# Altium project RX.PrjPCB
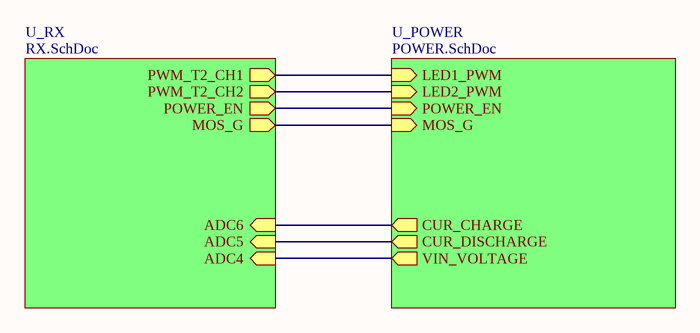
[diagram p0: TOP.SchDoc]
3 sheets, 116 parts. Net scope: hierarchical (ports join the sheet entries above them; power ports are global).
Board file: RX_fp.PcbDoc
Sheets:
  TOP.SchDoc
    U_POWER = POWER.SchDoc
    U_RX = RX.SchDoc

## Sheet TOP.SchDoc
size A4

### Sub-sheets
U_POWER = POWER.SchDoc: CUR_CHARGE (out), CUR_DISCHARGE (out), POWER_EN (in), MOS_G (in), LED1_PWM (in), LED2_PWM (in), VIN_VOLTAGE (out)
U_RX = RX.SchDoc: PWM_T2_CH1 (out), PWM_T2_CH2 (out), ADC4 (in), ADC5 (in), ADC6 (in), POWER_EN (out), MOS_G (out)

### Nets
CUR_CHARGE: sheet U_POWER/CUR_CHARGE, sheet U_RX/ADC6
CUR_DISCHARGE: sheet U_POWER/CUR_DISCHARGE, sheet U_RX/ADC5
LED1: sheet U_POWER/LED1_PWM, sheet U_RX/PWM_T2_CH1
LED2: sheet U_POWER/LED2_PWM, sheet U_RX/PWM_T2_CH2
MOS_G: sheet U_POWER/MOS_G, sheet U_RX/MOS_G
POWER_EN: sheet U_POWER/POWER_EN, sheet U_RX/POWER_EN
NetC1_1: sheet U_POWER/VIN_VOLTAGE, sheet U_RX/ADC4

## Sheet POWER.SchDoc
size A4
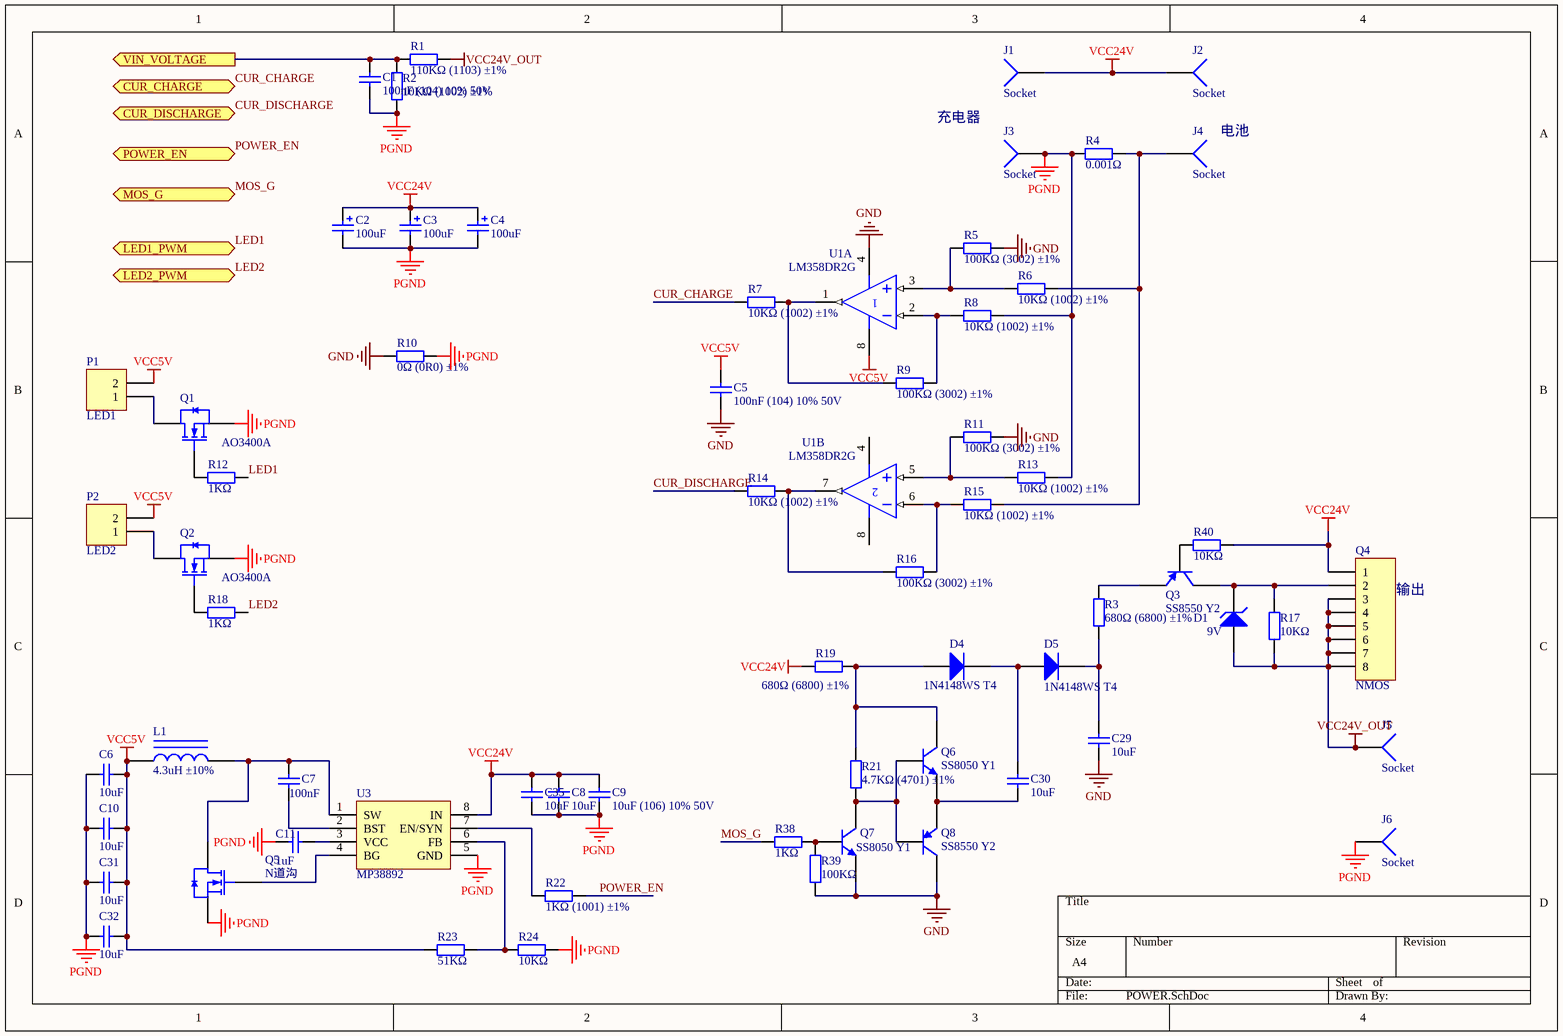
[diagram p1: POWER.SchDoc]

### Parts
C1  100nF (104) 10% 50V  [0603_C]
C2  100uF  [CC6.56.5]
C3  100uF  [CC6.56.5]
C4  100uF  [CC6.56.5]
C5  100nF (104) 10% 50V  [0603_C]
C6  10uF  [1206_C]
C7  100nF  [0603_C]
C8  10uF  [1206_C]
C9  10uF (106) 10% 50V  [1206_C]
C10  10uF  [1206_C]
C11  1uF  [0603_C]
C29  10uF  [0805_C]
C30  10uF  [0805_C]
C31  10uF  [1206_C]
C32  10uF  [1206_C]
C35  10uF  [1206_C]
D1  9V  [LL-34]
D4  1N4148WS T4  [SOD-323]
D5  1N4148WS T4  [SOD-323]
J1  Socket  [PIN1]
J2  Socket  [PIN1]
J3  Socket  [PIN1]
J4  Socket  [PIN1]
J5  Socket  [PIN1]
J6  Socket  [PIN1]
L1  4.3uH ±10%  [2225]
P1  LED1  [HDR1X2]
P2  LED2  [HDR1X2]
Q1  AO3400A  [SOT-23-3L]
Q2  AO3400A  [SOT-23-3L]
Q3  SS8550 Y2  [SOT-23(SOT-23-3)]
Q4  NMOS  [TO-263-7]
Q5  N道沟  [TO-252-2]
Q6  SS8050 Y1  [SOT-23(SOT-23-3)]
Q7  SS8050 Y1  [SOT-23(SOT-23-3)]
Q8  SS8550 Y2  [SOT-23(SOT-23-3)]
R1  110KΩ (1103) ±1%  [0603_R]
R2  10KΩ (1002) ±1%  [0603_R]
R3  680Ω (6800) ±1%  [0603_R]
R4  0.001Ω  [2512_R]
R5  100KΩ (3002) ±1%  [0603_R]
R6  10KΩ (1002) ±1%  [0603_R]
R7  10KΩ (1002) ±1%  [0603_R]
R8  10KΩ (1002) ±1%  [0603_R]
R9  100KΩ (3002) ±1%  [0603_R]
R10  0Ω (0R0) ±1%  [0603_R]
R11  100KΩ (3002) ±1%  [0603_R]
R12  1KΩ  [0603_R]
R13  10KΩ (1002) ±1%  [0603_R]
R14  10KΩ (1002) ±1%  [0603_R]
R15  10KΩ (1002) ±1%  [0603_R]
R16  100KΩ (3002) ±1%  [0603_R]
R17  10KΩ  [0603_R]
R18  1KΩ  [0603_R]
R19  680Ω (6800) ±1%  [0603_R]
R21  4.7KΩ (4701) ±1%  [0603_R]
R22  1KΩ (1001) ±1%  [0603_R]
R23  51KΩ  [0603_R]
R24  10KΩ  [0603_R]
R38  1KΩ  [0603_R]
R39  100KΩ  [0603_R]
R40  10KΩ  [0603_R]
U1  LM358DR2G  [SOIC-8_150mil]  (parts A,B of 2)
U3  MP38892  [SOIC-8_EP_150mil]

### Ports
CUR_CHARGE (out), CUR_DISCHARGE (out), LED1_PWM (in), LED2_PWM (in), MOS_G (in), POWER_EN (in), VIN_VOLTAGE (out)

### Nets
GND: C5.2 C29.1 Q7.2(E) Q8.3(C) R5.1 R10.1 R11.1 R39.1 U1.4(V-)
PGND: C1.2 C2.2 C3.2 C4.2 C6.2 C8.1 C9.1 C10.2 C11.2 C31.2 C32.2 C35.2 J3.1 J6.1 Q1.2(S) Q2.2(S) Q5.2(S) R2.1 R4.2 R8.2 R10.2 R13.2 R24.1 U3.5(GND)
VCC5V: C5.1 C6.1 C10.1 C31.1 C32.1 L1.1 P1.2 P2.2 R23.2 U1.8(V+)
VCC24V: C2.1 C3.1 C4.1 C8.2 C9.2 C35.1 J1.1 J2.1 Q4.1 R19.2 R40.1 U3.8(IN)
VCC24V_OUT: D1.1(A) J5.1 Q4.3 Q4.4 Q4.5 Q4.6 Q4.7 Q4.8 R1.1 R17.1
CUR_CHARGE: R7.1 ; port CUR_CHARGE
CUR_DISCHARGE: R14.1 ; port CUR_DISCHARGE
LED1: R12.1 ; port LED1_PWM
LED2: R18.1 ; port LED2_PWM
MOS_G: R38.1 ; port MOS_G
POWER_EN: R22.2 ; port POWER_EN
NetC1_1: C1.1 R1.2 R2.2 ; port VIN_VOLTAGE
NetC7_1: C7.1 U3.2(BST)
NetC7_2: C7.2 L1.2 Q5.3(D) U3.1(SW)
NetC11_1: C11.1 U3.3(VCC)
NetC29_2: C29.2 D5.2(K) R3.2
NetC30_1: C30.1 Q6.2(E) Q8.2(E)
NetC30_2: C30.2 D4.2(K) D5.1(A)
NetD1_2: D1.2(K) Q3.3(C) Q4.2 R17.2
NetD4_1: D4.1(A) Q6.3(C) R19.1 R21.2
NetJ4_1: J4.1 R4.1 R6.2 R15.2
NetP1_1: P1.1 Q1.3(D)
NetP2_1: P2.1 Q2.3(D)
NetQ1_1: Q1.1(G) R12.2
NetQ2_1: Q2.1(G) R18.2
NetQ3_1: Q3.1(B) R40.2
NetQ3_2: Q3.2(E) R3.1
NetQ5_1: Q5.1(G) U3.4(BG)
NetQ6_1: Q6.1(B) Q7.3(C) Q8.1(B) R21.1
NetQ7_1: Q7.1(B) R38.2 R39.2
NetR5_2: R5.2 R6.1 U1.3(IN+)
NetR7_2: R7.2 R9.1 U1.1(OUT)
NetR8_1: R8.1 R9.2 U1.2(IN-)
NetR11_2: R11.2 R13.1 U1.5(IN+)
NetR14_2: R14.2 R16.1 U1.7(OUT)
NetR15_1: R15.1 R16.2 U1.6(IN-)
NetR22_1: R22.1 U3.7(EN/SYN)
NetR23_1: R23.1 R24.2 U3.6(FB)

### Notes on the sheet
- 充电器
- (near J4) 电池
- (near Q4) 输出

### Library data of the parts
C1 C5 C7 = 0603 100nF (104) 10% 50V: 贴片电容; ComponentLink1Description: 供应商链接; ComponentLink1URL: http://www.szlcsc.com/product/details_15331.html; Package: 0603; Supplier: LC; SuppliersPartNumber: C14663
C2-C4 = 3528 100uF (107) 10% 6.3V: 钽电容; ComponentLink1Description: 供应商链接; ComponentLink1URL: http://www.szlcsc.com/product/details_16815.html; Package: 3528; Supplier: LC; SuppliersPartNumber: C16133
C6 C8-C10 C31 C32 C35 = 1206 10uF (106) 10% 50V: 贴片电容; ComponentLink1Description: 供应商链接; ComponentLink1URL: http://www.szlcsc.com/product/details_14236.html; Package: 1206; Supplier: LC; SuppliersPartNumber: C13585
C11 = 0603 1uF (105) 10% 50V: 贴片电容; ComponentLink1Description: 供应商链接; ComponentLink1URL: http://www.szlcsc.com/product/details_16531.html; Package: 0603; Supplier: LC; SuppliersPartNumber: C15849
C29 C30 = 0805 10uF (106) 10% 25V: 贴片电容; ComponentLink1Description: 供应商链接; ComponentLink1URL: http://www.szlcsc.com/product/details_16532.html; Package: 0805; Supplier: LC; SuppliersPartNumber: C15850
D1 = LL-34 ZMM5V6: 稳压二极管; ComponentLink1Description: 供应商链接; ComponentLink1URL: http://www.szlcsc.com/product/details_8541.html; Package: LL-34; Supplier: LC; SuppliersPartNumber: C8062
D4 D5 = SOD-323 1N4148WS T4: 二极管; ComponentLink1Description: 供应商链接; ComponentLink1URL: http://www.szlcsc.com/product/details_2485.html; Package: SOD-323; Supplier: LC; SuppliersPartNumber: C2128
L1 = 0805 10uH 10%: 贴片电感; ComponentLink1Description: 供应商链接; ComponentLink1URL: http://www.szlcsc.com/product/details_1398.html; Package: 0805; Supplier: LC; SuppliersPartNumber: C1046
P1 P2 = Header 2: Header, 2-Pin; LatestRevisionDate: 17-Jul-2002; LatestRevisionNote: Re-released for DXP Platform.; Publisher: Altium Limited
Q1 Q2 = AO3400A N道沟 X0YV1T SOT-23: MOS(场效应管); ComponentLink1Description: 供应商链接; ComponentLink1URL: http://www.szlcsc.com/product/details_21629.html; Package: SOT-23; Supplier: LC; SuppliersPartNumber: C20917
Q3 Q8 = SOT-23 SS8550 Y2: 三极管; ComponentLink1Description: 供应商链接; ComponentLink1URL: http://www.szlcsc.com/product/details_9037.html; Package: SOT-23; Supplier: LC; SuppliersPartNumber: C8542
Q4 = Header 8: Header, 8-Pin; pin to pad: 1>0 2>1 3>2 4>3 5>4 6>5 7>6 8>7; LatestRevisionDate: 17-Jul-2002; LatestRevisionNote: Re-released for DXP Platform.; Publisher: Altium Limited
Q5 = AO3400A N道沟 X0YV1T SOT-23: MOS(场效应管); pin to pad: 2>3 3>2; ComponentLink1Description: 供应商链接; ComponentLink1URL: http://www.szlcsc.com/product/details_21629.html; Package: SOT-23; Supplier: LC; SuppliersPartNumber: C20917
Q6 Q7 = SOT-23 SS8050 Y1: 三极管; ComponentLink1Description: 供应商链接; ComponentLink1URL: http://www.szlcsc.com/product/details_2507.html; Package: SOT-23; Supplier: LC; SuppliersPartNumber: C2150
R1 = 0603 110KΩ (1103) 1%: 贴片电阻; ComponentLink1Description: 供应商链接; ComponentLink1URL: http://www.szlcsc.com/product/details_26548.html; Package: 0603; Supplier: LC; SuppliersPartNumber: C25805
R2 R6-R8 R13-R15 R17 R24 R40 = 0603 10KΩ (1002) 1%: 贴片电阻; ComponentLink1Description: 供应商链接; ComponentLink1URL: http://www.szlcsc.com/product/details_26547.html; Package: 0603; Supplier: LC; SuppliersPartNumber: C25804
R3 R19 = 0603 680Ω (6800) 1%: 贴片电阻; ComponentLink1Description: 供应商链接; ComponentLink1URL: http://www.szlcsc.com/product/details_23955.html; Package: 0603; Supplier: LC; SuppliersPartNumber: C23228
R4 R10 = 0603 0Ω (0R0) 1%: 贴片电阻; ComponentLink1Description: 供应商链接; ComponentLink1URL: http://www.szlcsc.com/product/details_21903.html; Package: 0603; Supplier: LC; SuppliersPartNumber: C21189
R5 R9 R11 R16 R39 = 0603 30KΩ (3002) 1%: 贴片电阻; ComponentLink1Description: 供应商链接; ComponentLink1URL: http://www.szlcsc.com/product/details_23711.html; Package: 0603; Supplier: LC; SuppliersPartNumber: C22984
R12 R18 R22 R38 = 0603 1KΩ (1001) 1%: 贴片电阻; ComponentLink1Description: 供应商链接; ComponentLink1URL: http://www.szlcsc.com/product/details_21904.html; Package: 0603; Supplier: LC; SuppliersPartNumber: C21190
R21 = 0603 4.7KΩ (4701) 1%: 贴片电阻; ComponentLink1Description: 供应商链接; ComponentLink1URL: http://www.szlcsc.com/product/details_23889.html; Package: 0603; Supplier: LC; SuppliersPartNumber: C23162
R23 = 0603 51KΩ (5102) 1%: 贴片电阻; ComponentLink1Description: 供应商链接; ComponentLink1URL: http://www.szlcsc.com/product/details_23923.html; Package: 0603; Supplier: LC; SuppliersPartNumber: C23196
U1 = LM358DR2G: 通用运放; ComponentLink1Description: 供应商链接; ComponentLink1URL: http://www.szlcsc.com/product/details_8427.html; Package: SOIC-8; Supplier: LC; SuppliersPartNumber: C7950
J1-J6 = Socket: LatestRevisionDate: 17-Jul-2002; LatestRevisionNote: Re-released for DXP Platform.; Publisher: Altium Limited

## Sheet RX.SchDoc
size A4
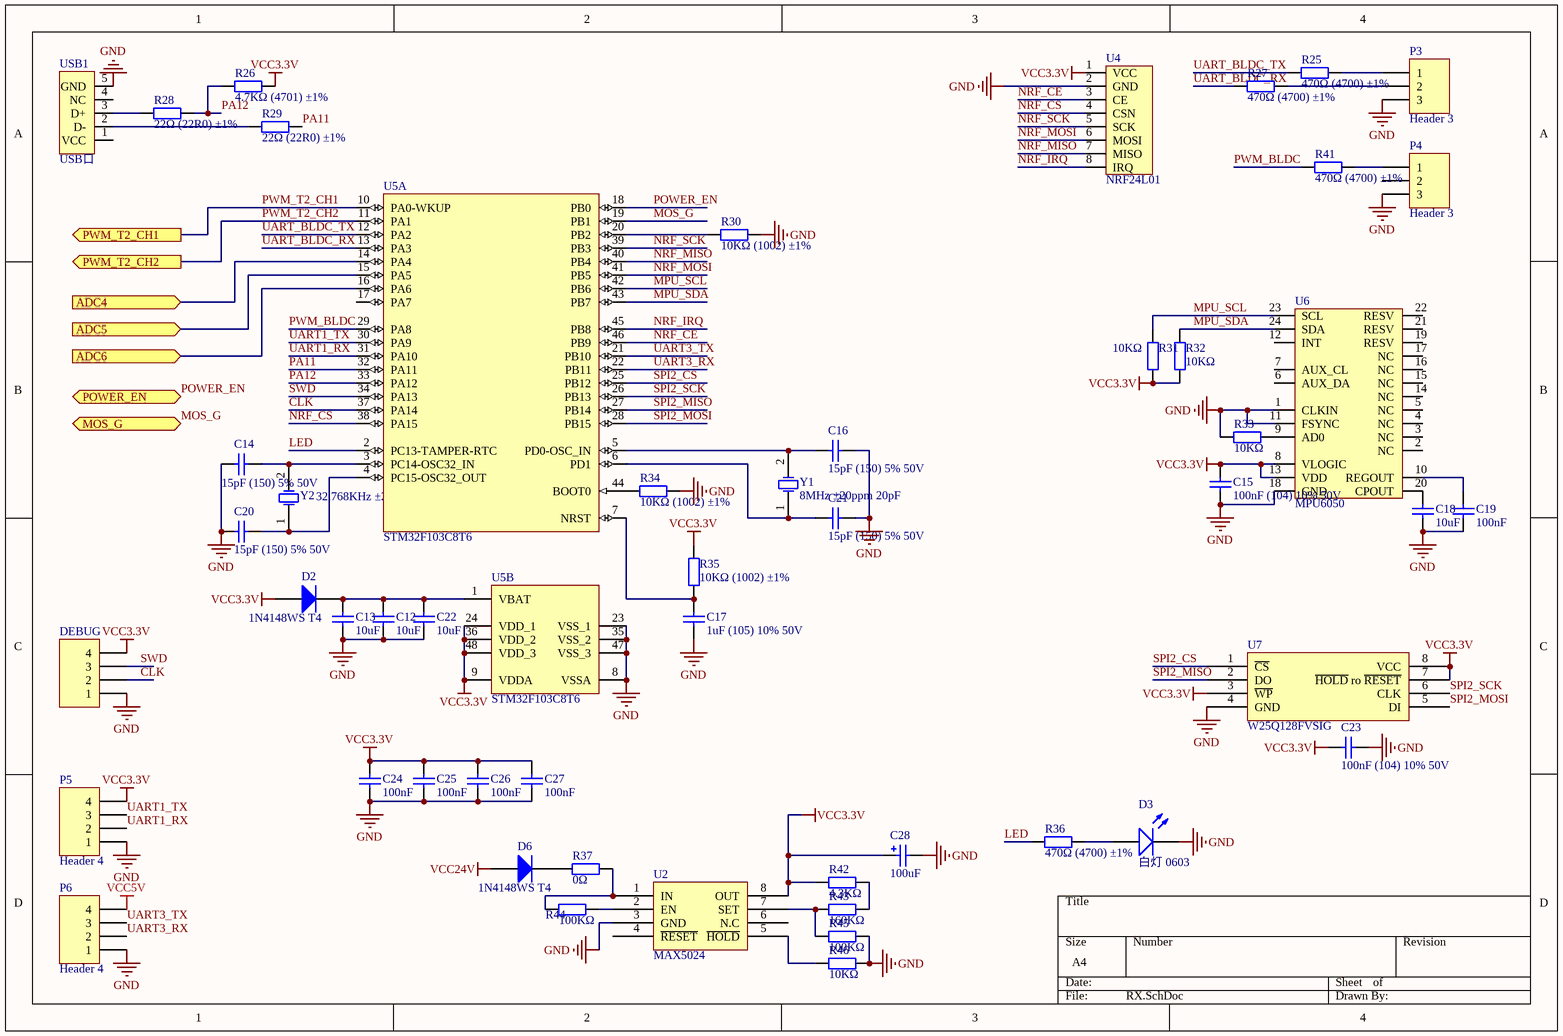
[diagram p2: RX.SchDoc]

### Parts
C12  10uF  [0603_C]
C13  10uF  [0603_C]
C14  15pF (150) 5% 50V  [0603_C]
C15  100nF (104) 10% 50V  [0603_C]
C16  15pF (150) 5% 50V  [0603_C]
C17  1uF (105) 10% 50V  [0603_C]
C18  10uF  [0603_C]
C19  100nF  [0603_C]
C20  15pF (150) 5% 50V  [0603_C]
C21  15pF (150) 5% 50V  [0603_C]
C22  10uF  [0603_C]
C23  100nF (104) 10% 50V  [0603_C]
C24  100nF  [0603_C]
C25  100nF  [0603_C]
C26  100nF  [0603_C]
C27  100nF  [0603_C]
C28  100uF  [CASE-B_3528]
D2  1N4148WS T4  [SOD-323]
D3  白灯 0603  [0603_LED_S1]
D6  1N4148WS T4  [SOD-323]
DEBUG  Header 4  [HDR1X4]  (value not drawn)
P3  Header 3  [HDR1X3]
P4  Header 3  [HDR1X3]
P5  Header 4  [HDR1X4]
P6  Header 4  [HDR1X4]
R25  470Ω (4700) ±1%  [0603_R]
R26  4.7KΩ (4701) ±1%  [0603_R]
R27  470Ω (4700) ±1%  [0603_R]
R28  22Ω (22R0) ±1%  [0603_R]
R29  22Ω (22R0) ±1%  [0603_R]
R30  10KΩ (1002) ±1%  [0603_R]
R31  10KΩ  [0603_R]
R32  10KΩ  [0603_R]
R33  10KΩ  [0603_R]
R34  10KΩ (1002) ±1%  [0603_R]
R35  10KΩ (1002) ±1%  [0603_R]
R36  470Ω (4700) ±1%  [0603_R]
R37  0Ω  [0805_R]
R41  470Ω (4700) ±1%  [0603_R]
R42  4.3KΩ  [0603_R]
R43  160KΩ  [0603_R]
R44  100KΩ  [0603_R]
R45  100KΩ  [0603_R]
R46  10KΩ  [0603_R]
U2  MAX5024  [SOIC-8_EP_150mil]
U4  NRF24L01  [miniNRF24L01]
U5  STM32F103C8T6  [LQFP-48_7x7x05P]  (parts A,B of 2)
U6  MPU6050  [QFN24]
U7  W25Q128FVSIG  [SOIC-8_208mil]
USB1  USB口  [MICRO USB]
Y1  8MHz ±20ppm 20pF  [SMD-3215_2P FC - 135]
Y2  32.768KHz ±20ppm 12.5pF  [SMD-3215_2P FC - 135]

### Ports
ADC4 (in), ADC5 (in), ADC6 (in), MOS_G (out), POWER_EN (out), PWM_T2_CH1 (out), PWM_T2_CH2 (out)

### Nets
GND: C12.1 C13.1 C14.1 C15.2 C16.2 C17.1 C18.1 C19.2 C20.1 C21.2 C22.1 C23.1 C24.2 C25.2 C26.2 C27.2 C28.2 D3.K DEBUG.1 P3.3 P4.3 P5.1 P6.1 R30.2 R33.1 R34.2 R45.2 R46.2 U2.3(GND) U4.2(GND) U5.8(VSSA) U5.23(VSS_1) U5.35(VSS_2) U5.47(VSS_3) U6.1(CLKIN) U6.11(FSYNC) U6.18(GND) U7.4(GND) USB1.5(GND)
VCC3.3V: C15.1 C23.2 C24.1 C25.1 C26.1 C27.1 C28.1 D2.1(A) DEBUG.4 P5.4 R26.2 R31.1 R32.2 R35.2 R42.1 U2.8(OUT) U4.1(VCC) U5.9(VDDA) U5.24(VDD_1) U5.36(VDD_2) U5.48(VDD_3) U6.8(VLOGIC) U6.13(VDD) U7.3(~{WP}) U7.7(~{HOLD}_ro_~{RESET}) U7.8(VCC)
VCC5V: P6.4
VCC24V: D6.1(A)
CLK: DEBUG.2 U5.37(PA14)
CUR_CHARGE: U5.16(PA6) ; port ADC6
CUR_DISCHARGE: U5.15(PA5) ; port ADC5
LED: R36.1 U5.2(PC13-TAMPER-RTC)
MOS_G: U5.19(PB1) ; port MOS_G
MPU_SCL: R31.2 U5.42(PB6) U6.23(SCL)
MPU_SDA: R32.1 U5.43(PB7) U6.24(SDA)
NRF_CE: U4.3(CE) U5.46(PB9)
NRF_CS: U4.4(CSN) U5.38(PA15)
NRF_IRQ: U4.8(IRQ) U5.45(PB8)
NRF_MISO: U4.7(MISO) U5.40(PB4)
NRF_MOSI: U4.6(MOSI) U5.41(PB5)
NRF_SCK: U4.5(SCK) U5.39(PB3)
PA11: R29.2 U5.32(PA11)
PA12: R26.1 R28.2 U5.33(PA12)
POWER_EN: U5.18(PB0) ; port POWER_EN
PWM_BLDC: R41.1 U5.29(PA8)
PWM_T2_CH1: U5.10(PA0-WKUP) ; port PWM_T2_CH1  [project net LED1]
PWM_T2_CH2: U5.11(PA1) ; port PWM_T2_CH2  [project net LED2]
SPI2_CS: U5.25(PB12) U7.1(~{CS})
SPI2_MISO: U5.27(PB14) U7.2(DO)
SPI2_MOSI: U5.28(PB15) U7.5(DI)
SPI2_SCK: U5.26(PB13) U7.6(CLK)
SWD: DEBUG.3 U5.34(PA13)
UART1_RX: P5.2 U5.31(PA10)
UART1_TX: P5.3 U5.30(PA9)
UART3_RX: P6.2 U5.22(PB11)
UART3_TX: P6.3 U5.21(PB10)
UART_BLDC_RX: R27.1 U5.13(PA3)
UART_BLDC_TX: R25.1 U5.12(PA2)
NetC1_1: U5.14(PA4) ; port ADC4
NetC12_2: C12.2 C13.2 C22.2 D2.2(K) U5.1(VBAT)
NetC14_2: C14.2 U5.3(PC14-OSC32_IN) Y2.2(OSC2)
NetC16_1: C16.1 U5.5(PD0-OSC_IN) Y1.2(OSC2)
NetC17_2: C17.2 R35.1 U5.7(NRST)
NetC18_2: C18.2 U6.20(CPOUT)
NetC19_1: C19.1 U6.10(REGOUT)
NetC20_2: C20.2 U5.4(PC15-OSC32_OUT) Y2.1(OSC1)
NetC21_1: C21.1 U5.6(PD1) Y1.1(OSC1)
NetD3_A: D3.A R36.2
NetD6_2: D6.2(K) R37.1
NetP3_1: P3.1 R25.2
NetP3_2: P3.2 R27.2
NetP4_1: P4.1 R41.2
NetR28_1: R28.1 USB1.3(D+)
NetR29_1: R29.1 USB1.2(D-)
NetR30_1: R30.1 U5.20(PB2)
NetR33_2: R33.2 U6.9(AD0)
NetR34_1: R34.1 U5.44(BOOT0)
NetR37_2: R37.2 R44.1 U2.1(IN)
NetR42_2: R42.2 R43.2
NetR43_1: R43.1 R45.1 U2.7(SET)
NetR44_2: R44.2 U2.2(EN)
NetR46_1: R46.1 U2.5(~{HOLD})

Not connected (* = marked no-connect by the designer): P4 2; U2 4(~{RESET}) 6(N.C); U5 17(PA7); U6 2(NC) 3(NC) 4(NC) 5(NC) 6(AUX_DA) 7(AUX_CL) 12(INT) 14(NC) 15(NC) 16(NC) 17(NC) 19(RESV) 21(RESV) 22(RESV); USB1 1(VCC) 4(NC)

### Library data of the parts
C12 C13 C18 C22 = 0603 10uF (106) 10% 10V: 贴片电容; ComponentLink1Description: 供应商链接; ComponentLink1URL: http://www.szlcsc.com/product/details_20411.html; Package: 0603; Supplier: LC; SuppliersPartNumber: C19702
C14 C16 C20 C21 = 0603 15pF (150) 5% 50V: 贴片电容; ComponentLink1Description: 供应商链接; ComponentLink1URL: http://www.szlcsc.com/product/details_1996.html; Package: 0603; Supplier: LC; SuppliersPartNumber: C1644
C15 C19 C23-C27 = 0603 100nF (104) 10% 50V: 贴片电容; ComponentLink1Description: 供应商链接; ComponentLink1URL: http://www.szlcsc.com/product/details_15331.html; Package: 0603; Supplier: LC; SuppliersPartNumber: C14663
C17 = 0603 1uF (105) 10% 50V: 贴片电容; ComponentLink1Description: 供应商链接; ComponentLink1URL: http://www.szlcsc.com/product/details_16531.html; Package: 0603; Supplier: LC; SuppliersPartNumber: C15849
C28 = 3528 100uF (107) 10% 6.3V: 钽电容; ComponentLink1Description: 供应商链接; ComponentLink1URL: http://www.szlcsc.com/product/details_16815.html; Package: 3528; Supplier: LC; SuppliersPartNumber: C16133
D2 D6 = SOD-323 1N4148WS T4: 二极管; ComponentLink1Description: 供应商链接; ComponentLink1URL: http://www.szlcsc.com/product/details_2485.html; Package: SOD-323; Supplier: LC; SuppliersPartNumber: C2128
D3 = 0603 白灯: 发光二极管; ComponentLink1Description: 供应商链接; ComponentLink1URL: http://www.szlcsc.com/product/details_2663.html; Package: 0603; Supplier: LC; SuppliersPartNumber: C2290
DEBUG P5 P6 = Header 4: Header, 4-Pin; LatestRevisionDate: 17-Jul-2002; LatestRevisionNote: Re-released for DXP Platform.; Publisher: Altium Limited
P3 P4 = Header 3: Header, 3-Pin; LatestRevisionDate: 17-Jul-2002; LatestRevisionNote: Re-released for DXP Platform.; Publisher: Altium Limited
R25 R27 R36 R41 = 0603 470Ω (4700) 1%: 贴片电阻; ComponentLink1Description: 供应商链接; ComponentLink1URL: http://www.szlcsc.com/product/details_23906.html; Package: 0603; Supplier: LC; SuppliersPartNumber: C23179
R26 = 0603 4.7KΩ (4701) 1%: 贴片电阻; ComponentLink1Description: 供应商链接; ComponentLink1URL: http://www.szlcsc.com/product/details_23889.html; Package: 0603; Supplier: LC; SuppliersPartNumber: C23162
R28 R29 = 0603 22Ω (22R0) 1%: 贴片电阻; ComponentLink1Description: 供应商链接; ComponentLink1URL: http://www.szlcsc.com/product/details_24078.html; Package: 0603; Supplier: LC; SuppliersPartNumber: C23345
R30-R35 R46 = 0603 10KΩ (1002) 1%: 贴片电阻; ComponentLink1Description: 供应商链接; ComponentLink1URL: http://www.szlcsc.com/product/details_26547.html; Package: 0603; Supplier: LC; SuppliersPartNumber: C25804
R37 = 0805 0Ω (0R0) 1%: 贴片电阻; ComponentLink1Description: 供应商链接; ComponentLink1URL: http://www.szlcsc.com/product/details_18165.html; Package: 0805; Supplier: LC; SuppliersPartNumber: C17477
R42 = 0603 4.3KΩ (4301) 1%: 贴片电阻; ComponentLink1Description: 供应商链接; ComponentLink1URL: http://www.szlcsc.com/product/details_23886.html; Package: 0603; Supplier: LC; SuppliersPartNumber: C23159
R43 = 0603 160KΩ (1603) 1%: 贴片电阻; ComponentLink1Description: 供应商链接; ComponentLink1URL: http://www.szlcsc.com/product/details_23540.html; Package: 0603; Supplier: LC; SuppliersPartNumber: C22813
R44 R45 = 0603 100KΩ (1003) 1%: 贴片电阻; ComponentLink1Description: 供应商链接; ComponentLink1URL: http://www.szlcsc.com/product/details_26546.html; Package: 0603; Supplier: LC; SuppliersPartNumber: C25803
U2 = MAX5024: LDO 65Vmax
U5 = STM32F103C8T6: ARM; ComponentLink1Description: 供应商链接; ComponentLink1URL: http://www.szlcsc.com/product/details_9243.html; Package: LQFP-48_7x7x05P; Supplier: LC; SuppliersPartNumber: C8734
U6 = MPU6050: 9轴运动处理传感器
U7 = W25Q128FVSIG: Flash ROM; ComponentLink1Description: 供应商链接; ComponentLink1URL: http://www.szlcsc.com/product/details_36072.html; Package: SOIC-8; Supplier: LC; SuppliersPartNumber: C35101
Y1 = SMD-5032_2P 8MHz 20ppm 20pF: 贴片晶振; ComponentLink1Description: 供应商链接; ComponentLink1URL: http://www.szlcsc.com/product/details_117214.html; Package: SMD-5032_2P; Supplier: LC; SuppliersPartNumber: C115962
Y2 = SMD-3215_2P 32.768KHz 20ppm 12.5pF: 贴片晶振; ComponentLink1Description: 供应商链接; ComponentLink1URL: http://www.szlcsc.com/product/details_33310.html; Package: SMD-3215_2P; Supplier: LC; SuppliersPartNumber: C32346

## Nets that join several sheets
GND: POWER (9 pins), RX (39 pins)
VCC5V: POWER (10 pins), RX (P6.4)
VCC24V: POWER (12 pins), RX (D6.1)
CUR_CHARGE: POWER (R7.1), RX (U5.16)
CUR_DISCHARGE: POWER (R14.1), RX (U5.15)
LED1: POWER (R12.1), RX (U5.10)
LED2: POWER (R18.1), RX (U5.11)
MOS_G: POWER (R38.1), RX (U5.19)
NetC1_1: POWER (C1.1 R1.2 R2.2), RX (U5.14)
POWER_EN: POWER (R22.2), RX (U5.18)